# EAGLE design Plat10con (EAGLE 9.6.2)
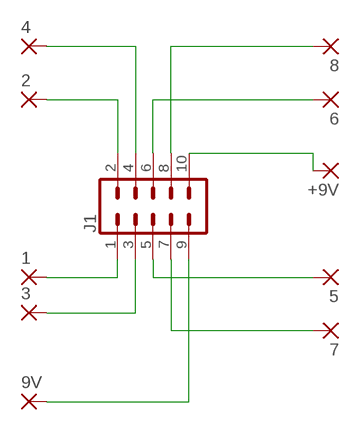
[diagram p0: schematic, sheet 1]

## Parts
1  1,6/0,9  [1,6/0,9]
2  1,6/0,9  [1,6/0,9]
3  1,6/0,9  [1,6/0,9]
4  1,6/0,9  [1,6/0,9]
5  1,6/0,9  [1,6/0,9]
6  1,6/0,9  [1,6/0,9]
7  1,6/0,9  [1,6/0,9]
8  1,6/0,9  [1,6/0,9]
9V  1,6/0,9  [1,6/0,9]
+9V  1,6/0,9  [1,6/0,9]
J1  CONN_05X2SHD  [2X5-SHROUDED]

## Nets
N$1: 4.1(P) J1.4
N$2: 2.1(P) J1.2
N$3: 1.1(P) J1.1
N$4: 3.1(P) J1.3
N$5: 9V.1(P) J1.9
N$6: 5.1(P) J1.5
N$7: 7.1(P) J1.7
N$8: 6.1(P) J1.6
N$9: 8.1(P) J1.8
N$10: +9V.1(P) J1.10

## Library data of the parts
1-8 9V +9V = wirepad:1,6/0,9: THROUGH-HOLE PAD
J1 = SparkFun-Connectors:CONN_05X2: Multi connection point. Often used as Generic Header-pin footprint for 0.1 inch spaced/style header connections For AVR SPI programming port, see special device with nice symbol: "AVR_SPI_PROG_5x2.dev" You can populate with any combo of single row headers, but if you'd like an exact match, check these: 2x5 AVR ICSP Male Header <https://www.sparkfun.com/products/778> (PRT-00778) 2x5 Pin Shrouded Header <https://www.sparkfun.com/products/8506> (PRT-08506) On any of the 0.1 inch spaced packages, you can populate with these: Break Away Headers - Straight <https://www.sparkfun.com/products/116> (PRT-00116) Break Away Male Headers - Right Angle <https://www.sparkfun.com/products/553> (PRT-00553) Female Headers <https://www.sparkfun.com/products/115> (PRT-00115) Break Away Headers - Machine Pin <https://www.sparkfun.com/products/117> (PRT-00117) Break Away Female Headers - Swiss Machine Pin <https://www.sparkfun.com/products/743> (PRT-00743) Special note: the shrouded connector mates well with our 5x2 ribbon cables: 2x5 Pin IDC Ribbon Cable <https://www.sparkfun.com/products/8535> (PRT-08535); PROD_ID: CONN-08671; SF_ID: PRT-08506

## Board
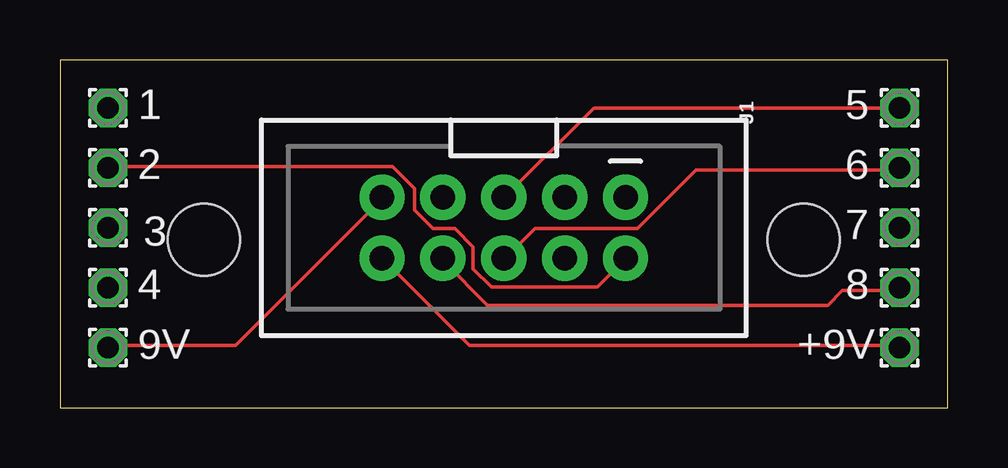
[diagram p1: board, top side]
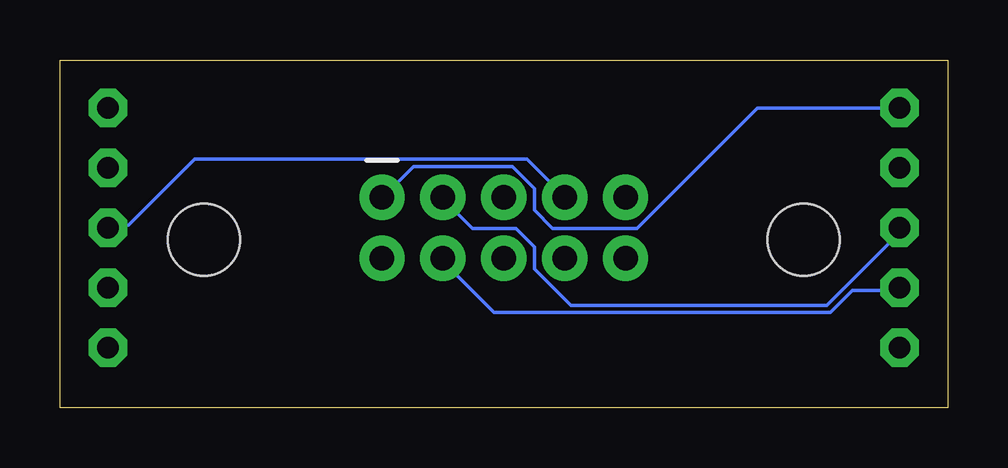
[diagram p2: board, bottom side, seen from below]

Size 37 x 14.5 mm. Coordinates in mm from the lower left corner, seen from the top.
Outline: 0,0 37,0 37,14.5 0,14.5 0,0
Copper layers (1*16): Top 0.035mm / dielectric 1.5mm / Bottom 0.035mm
Design rules "default": minimum track width 6mil, minimum drill 0.35mm, track to track 6mil, track to pad 6mil, pad to pad 6mil, via to via 6mil, smd to smd 6mil, copper to edge 40mil, drill to drill 6mil, minimum pad ring 10mil, minimum via ring 8mil, stop-mask expansion 4mil, vias tented up to drill 0mil, thermal gap 10mil
Holes 3 mm at 6,7 31,7

### Footprints (pad centres in the part's own frame; a part is rotated, then mirrored left to right if it is on the bottom)
1,6/0,9 = drill 0.914 pad 1.6 octagon: 1 0,0
2X5-SHROUDED = drill 1.016 pad 1.88: 1 -1.27,5.08; 2 1.27,5.08; 3 -1.27,2.54; 4 1.27,2.54; 5 -1.27,0; 6 1.27,0; 7 -1.27,-2.54; 8 1.27,-2.54; 9 -1.27,-5.08; 10 1.27,-5.08

### Placement (x,y rotation side)
1  2,12.5 0 top
2  2,10 0 top
3  2,7.5 0 top
4  2,5 0 top
5  35,12.5 0 top
6  35,10 0 top
7  35,7.5 0 top
8  35,5 0 top
9V  2,2.5 0 top
+9V  35,2.5 0 top
J1  18.5,7.5 270 top

### Tracks (layer width: path | path; a pad name or v marks a point on that pad's centre or on a via)
N$1
  Bottom 0.152: 4.1 2.13,4.88 3.96,4.88 4.88,3.96 18.9,3.96 21.03,6.1 J1.4
N$2
  Top 0.152: 2.1 2.13,10.06 13.87,10.06 14.78,9.14 14.78,8.23 15.54,7.47 16.46,7.47 17.22,6.71 17.22,5.79 17.98,5.03 22.4,5.03 23.47,6.1 J1.2
N$3
  Bottom 0.152: 1.1 2.13,12.5 7.92,12.5 12.95,7.47 16.46,7.47 17.22,8.23 17.22,9.14 18.14,10.06 22.25,10.06 23.47,8.84 J1.1
N$4
  Bottom 0.152: 3.1 2.13,7.47 2.13,7.16 5.03,4.27 15.7,4.27 17.22,5.79 17.22,6.71 17.98,7.47 19.81,7.47 21.03,8.69 J1.3
N$5
  Top 0.152: 9V.1 2.13,2.59 7.32,2.59 13.41,8.69 J1.9
N$6
  Top 0.152: 5.1 34.9,12.5 22.25,12.5 18.59,8.84 J1.5
N$7
  Bottom 0.152: 7.1 34.9,7.62 34.14,7.62 31.39,10.36 17.53,10.36 16,8.84 J1.7
N$8
  Top 0.152: 6.1 34.9,9.91 26.52,9.91 24.08,7.47 19.81,7.47 18.59,6.25 J1.6
N$9
  Top 0.152: 8.1 34.9,4.88 32.61,4.88 32,4.27 17.83,4.27 16,6.1 J1.8
N$10
  Top 0.152: +9V.1 34.9,2.59 17.07,2.59 13.56,6.1 J1.10